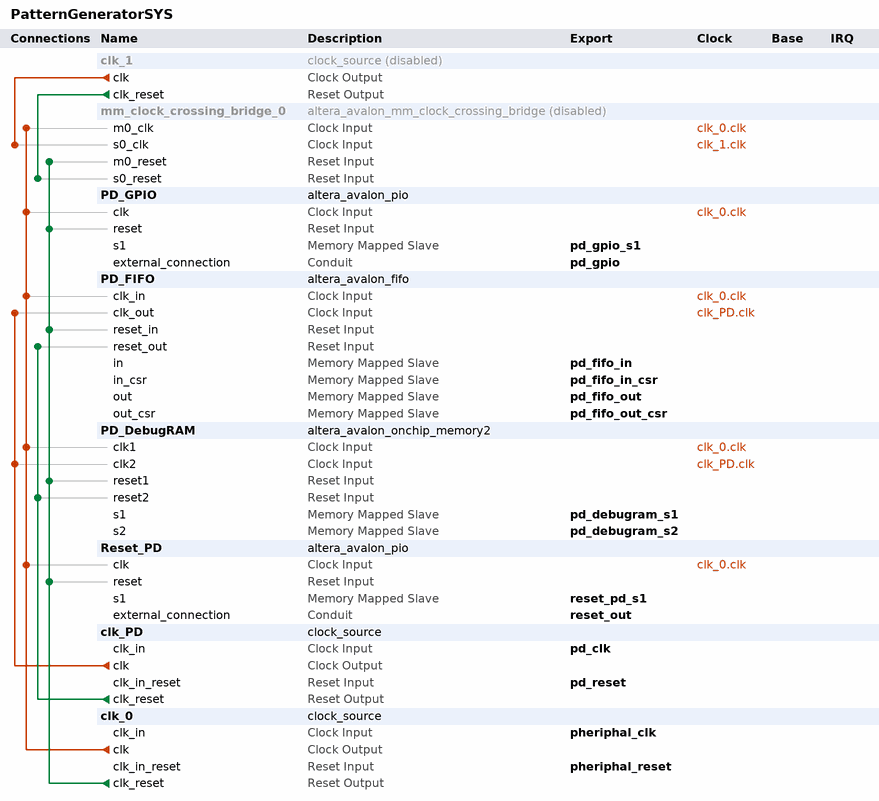
[diagram p0: system contents]
# Platform Designer (Qsys) system PatternGeneratorSYS, MAX 10 10M50DAF484I7G
# Parameters at their usual value, and those the tool derives, are not listed.
package require -exact qsys 18.1
create_system PatternGeneratorSYS
set_project_property DEVICE_FAMILY {MAX 10}
set_project_property DEVICE 10M50DAF484I7G

add_instance clk_1 clock_source 18.1
set_instance_property clk_1 ENABLED false
set_instance_parameter_value clk_1 clockFrequency 50000000

add_instance mm_clock_crossing_bridge_0 altera_avalon_mm_clock_crossing_bridge 18.1
set_instance_property mm_clock_crossing_bridge_0 ENABLED false
set_instance_parameter_value mm_clock_crossing_bridge_0 ADDRESS_WIDTH 15
set_instance_parameter_value mm_clock_crossing_bridge_0 COMMAND_FIFO_DEPTH 4
set_instance_parameter_value mm_clock_crossing_bridge_0 DATA_WIDTH 32
set_instance_parameter_value mm_clock_crossing_bridge_0 MASTER_SYNC_DEPTH 2
set_instance_parameter_value mm_clock_crossing_bridge_0 MAX_BURST_SIZE 1
set_instance_parameter_value mm_clock_crossing_bridge_0 RESPONSE_FIFO_DEPTH 4
set_instance_parameter_value mm_clock_crossing_bridge_0 SLAVE_SYNC_DEPTH 2
set_instance_parameter_value mm_clock_crossing_bridge_0 USE_AUTO_ADDRESS_WIDTH 0

add_instance PD_GPIO altera_avalon_pio 18.1
set_instance_parameter_value PD_GPIO bitModifyingOutReg true
set_instance_parameter_value PD_GPIO captureEdge true
set_instance_parameter_value PD_GPIO direction InOut
set_instance_parameter_value PD_GPIO edgeType FALLING
set_instance_parameter_value PD_GPIO irqType EDGE
set_instance_parameter_value PD_GPIO simDoTestBenchWiring true
set_instance_parameter_value PD_GPIO width 32

add_instance PD_FIFO altera_avalon_fifo 18.1
set_instance_parameter_value PD_FIFO bitsPerSymbol 16
set_instance_parameter_value PD_FIFO channelWidth 8
set_instance_parameter_value PD_FIFO errorWidth 8
set_instance_parameter_value PD_FIFO fifoDepth 1024
set_instance_parameter_value PD_FIFO fifoInputInterfaceOptions AVALONMM_WRITE
set_instance_parameter_value PD_FIFO fifoOutputInterfaceOptions AVALONMM_READ
set_instance_parameter_value PD_FIFO singleClockMode false
set_instance_parameter_value PD_FIFO symbolsPerBeat 2
set_instance_parameter_value PD_FIFO useIRQ false
set_instance_parameter_value PD_FIFO usePacket true
set_instance_parameter_value PD_FIFO useReadControl true

add_instance PD_DebugRAM altera_avalon_onchip_memory2 18.1
set_instance_parameter_value PD_DebugRAM dataWidth 32
set_instance_parameter_value PD_DebugRAM dualPort true
set_instance_parameter_value PD_DebugRAM initMemContent false
set_instance_parameter_value PD_DebugRAM initializationFileName onchip_mem.hex
set_instance_parameter_value PD_DebugRAM memorySize 64

add_instance Reset_PD altera_avalon_pio 18.1
set_instance_parameter_value Reset_PD bitModifyingOutReg true
set_instance_parameter_value Reset_PD captureEdge true
set_instance_parameter_value Reset_PD direction Output
set_instance_parameter_value Reset_PD edgeType FALLING
set_instance_parameter_value Reset_PD generateIRQ true
set_instance_parameter_value Reset_PD irqType EDGE
set_instance_parameter_value Reset_PD width 1

add_instance clk_PD clock_source 18.1
set_instance_parameter_value clk_PD clockFrequency 50000000

add_instance clk_0 clock_source 18.1
set_instance_parameter_value clk_0 clockFrequency 50000000

# connections
add_connection clk_0.clk mm_clock_crossing_bridge_0.m0_clk clock
add_connection clk_0.clk PD_DebugRAM.clk1 clock
add_connection clk_0.clk PD_FIFO.clk_in clock
add_connection clk_0.clk PD_GPIO.clk clock
add_connection clk_0.clk Reset_PD.clk clock
add_connection clk_1.clk mm_clock_crossing_bridge_0.s0_clk clock
add_connection clk_PD.clk PD_DebugRAM.clk2 clock
add_connection clk_PD.clk PD_FIFO.clk_out clock
add_connection clk_0.clk_reset mm_clock_crossing_bridge_0.m0_reset reset
add_connection clk_0.clk_reset PD_DebugRAM.reset1 reset
add_connection clk_0.clk_reset PD_FIFO.reset_in reset
add_connection clk_0.clk_reset PD_GPIO.reset reset
add_connection clk_0.clk_reset Reset_PD.reset reset
add_connection clk_1.clk_reset mm_clock_crossing_bridge_0.s0_reset reset
add_connection clk_PD.clk_reset PD_DebugRAM.reset2 reset
add_connection clk_PD.clk_reset PD_FIFO.reset_out reset

# exported interfaces
add_interface pd_clk clock sink
set_interface_property pd_clk EXPORT_OF clk_PD.clk_in
add_interface pd_debugram_s1 avalon slave
set_interface_property pd_debugram_s1 EXPORT_OF PD_DebugRAM.s1
add_interface pd_debugram_s2 avalon slave
set_interface_property pd_debugram_s2 EXPORT_OF PD_DebugRAM.s2
add_interface pd_fifo_in avalon slave
set_interface_property pd_fifo_in EXPORT_OF PD_FIFO.in
add_interface pd_fifo_in_csr avalon slave
set_interface_property pd_fifo_in_csr EXPORT_OF PD_FIFO.in_csr
add_interface pd_fifo_out avalon slave
set_interface_property pd_fifo_out EXPORT_OF PD_FIFO.out
add_interface pd_fifo_out_csr avalon slave
set_interface_property pd_fifo_out_csr EXPORT_OF PD_FIFO.out_csr
add_interface pd_gpio conduit end
set_interface_property pd_gpio EXPORT_OF PD_GPIO.external_connection
add_interface pd_gpio_s1 avalon slave
set_interface_property pd_gpio_s1 EXPORT_OF PD_GPIO.s1
add_interface pd_reset reset sink
set_interface_property pd_reset EXPORT_OF clk_PD.clk_in_reset
add_interface pheriphal_clk clock sink
set_interface_property pheriphal_clk EXPORT_OF clk_0.clk_in
add_interface pheriphal_reset reset sink
set_interface_property pheriphal_reset EXPORT_OF clk_0.clk_in_reset
add_interface reset_out conduit end
set_interface_property reset_out EXPORT_OF Reset_PD.external_connection
add_interface reset_pd_s1 avalon slave
set_interface_property reset_pd_s1 EXPORT_OF Reset_PD.s1

set_interconnect_requirement {$system} qsys_mm.clockCrossingAdapter HANDSHAKE
set_interconnect_requirement {$system} qsys_mm.enableEccProtection FALSE
set_interconnect_requirement {$system} qsys_mm.insertDefaultSlave FALSE
set_interconnect_requirement {$system} qsys_mm.maxAdditionalLatency 1

save_system PatternGeneratorSYS.qsys
